# EAGLE design opto_isolator (EAGLE 5.00)
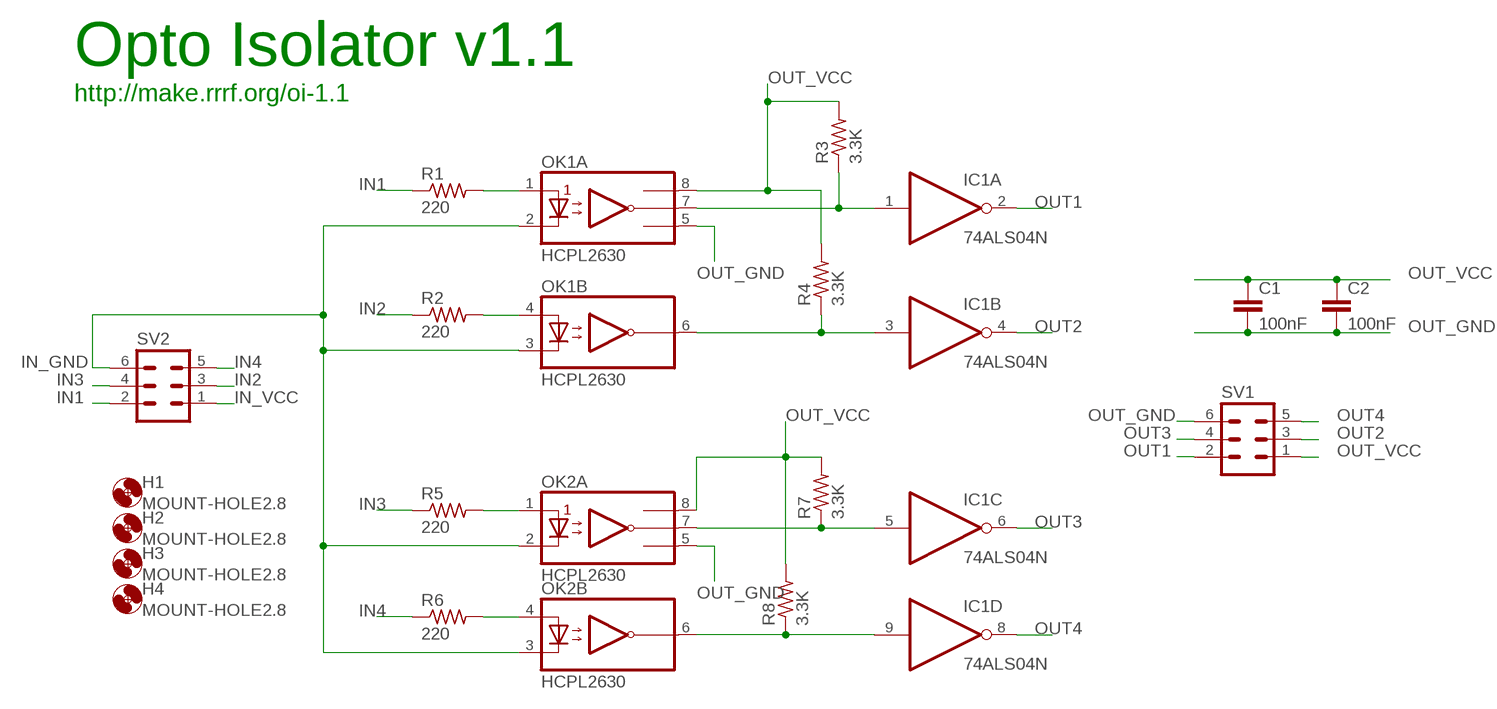
[diagram p0: schematic, sheet 1]

## Parts
C1  100nF  C-EU050-035X075  [C050-035X075]
C2  100nF  C-EU050-035X075  [C050-035X075]
H1  MOUNT-HOLE2.8  [2,8]
H2  MOUNT-HOLE2.8  [2,8]
H3  MOUNT-HOLE2.8  [2,8]
H4  MOUNT-HOLE2.8  [2,8]
IC1  74ALS04N  [DIL14]
OK1  HCPL2630  [DIL08]
OK2  HCPL2630  [DIL08]
R1  220  R-US_0207/2V  [0207/2V]
R2  220  R-US_0207/2V  [0207/2V]
R3  3.3K  R-US_0207/2V  [0207/2V]
R4  3.3K  R-US_0207/2V  [0207/2V]
R5  220  R-US_0207/2V  [0207/2V]
R6  220  R-US_0207/2V  [0207/2V]
R7  3.3K  R-US_0207/2V  [0207/2V]
R8  3.3K  R-US_0207/2V  [0207/2V]
SV1  ML6  [ML6]
SV2  ML6  [ML6]

## Nets
IN1: R1.1 SV2.2
IN2: R2.1 SV2.3
IN3: R5.1 SV2.4
IN4: R6.1 SV2.5
IN_GND: OK1.2(A:C1) OK1.3(B:C2) OK2.2(A:C1) OK2.3(B:C2) SV2.6
IN_VCC: SV2.1
N$1: OK2.4(B:A2) R6.2
N$2: OK2.1(A:A1) R5.2
N$3: OK1.1(A:A1) R1.2
N$4: OK1.4(B:A2) R2.2
N$5: IC1.5(C:I) OK2.7(A:VO1) R7.1
N$6: IC1.9(D:I) OK2.6(B:VO2) R8.1
N$7: IC1.3(B:I) OK1.6(B:VO2) R4.1
N$8: IC1.1(A:I) OK1.7(A:VO1) R3.1
OUT1: IC1.2(A:O) SV1.2
OUT2: IC1.4(B:O) SV1.3
OUT3: IC1.6(C:O) SV1.4
OUT4: IC1.8(D:O) SV1.5
OUT_GND: C1.2 C2.2 OK1.5(A:GND) OK2.5(A:GND) SV1.6
OUT_VCC: C1.1 C2.1 OK1.8(A:VCC) OK2.8(A:VCC) R3.2 R4.2 R7.2 R8.2 SV1.1
Unconnected: IC1.10(E:O) IC1.11(E:I) IC1.12(F:O) IC1.13(F:I)

## Notes on the sheet
- Opto Isolator v1.1
- http://make.rrrf.org/oi-1.1

## Power pins joined to a net without a drawn wire
GND: IC1.7(P:GND)
VCC: IC1.14(P:VCC)

## Library data of the parts
C1 C2 = rcl:C-EU: CAPACITOR, European symbol
H1-H4 = holes:MOUNT-HOLE: MOUNTING HOLE with drill center marker
IC1 = 74xx-us:74*04: Hex INVERTER
OK1 OK2 = optocoupler:HCPL2630: HEWLETT PACKARD OPTO COUPLER
R1-R8 = rcl:R-US_: RESISTOR, American symbol
SV1 SV2 = con-harting-ml:ML6: HARTING

## Board
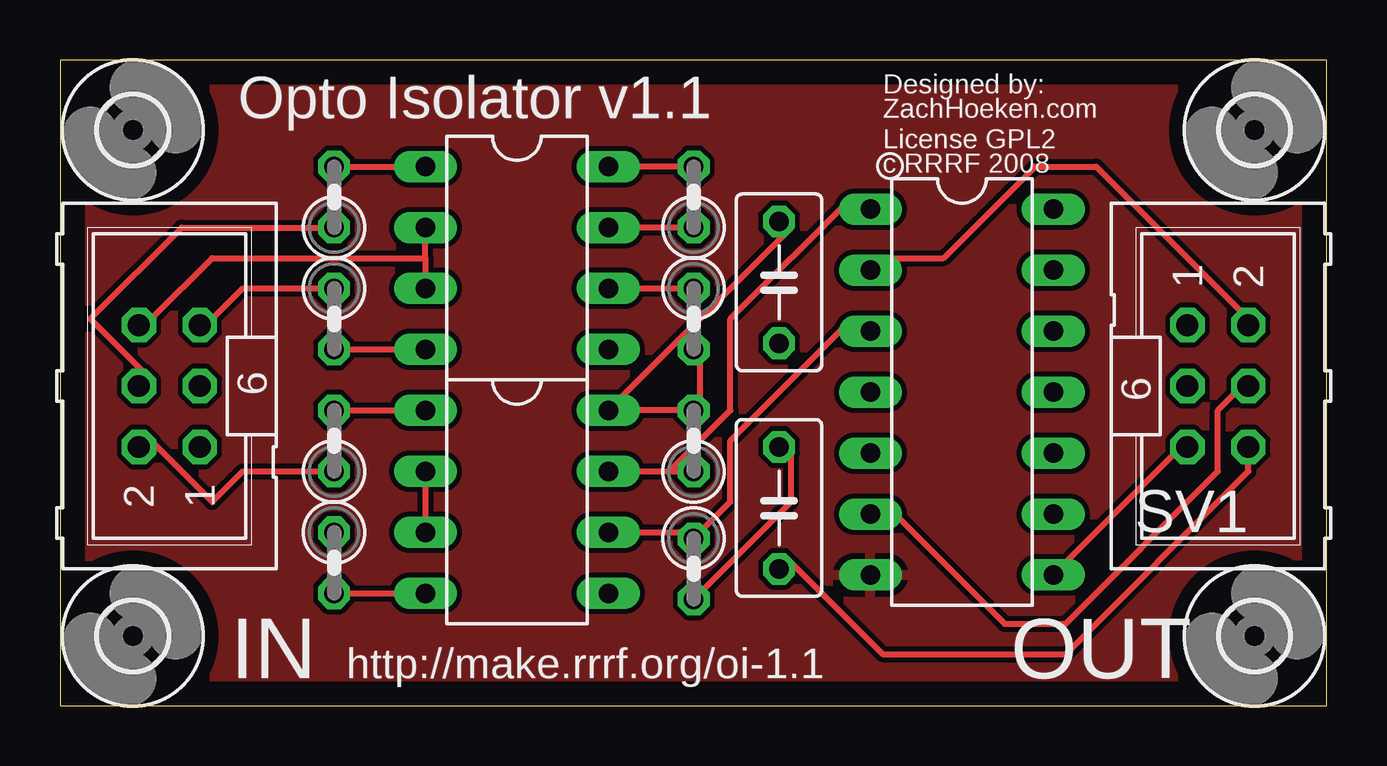
[diagram p1: board, top side]
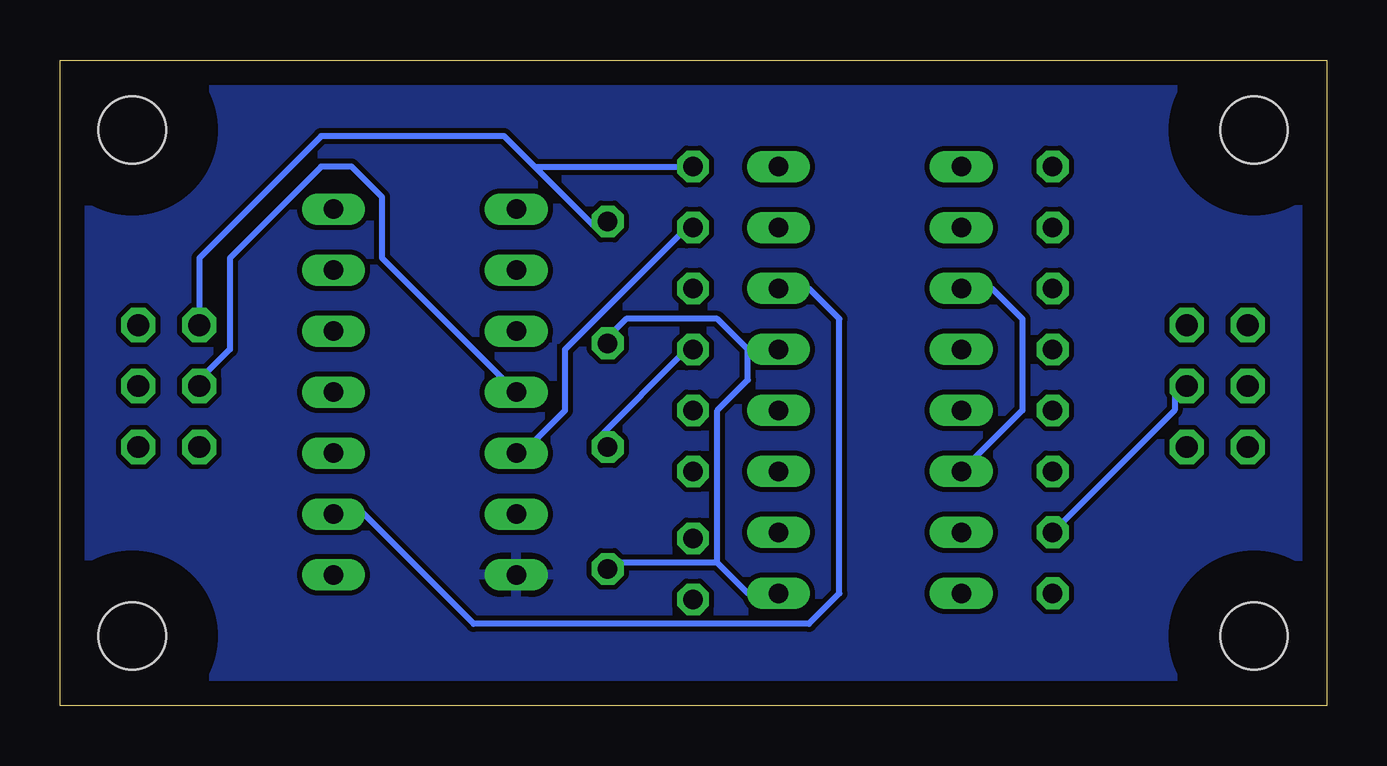
[diagram p2: board, bottom side, seen from below]

Size 52.78 x 26.91 mm. Coordinates in mm from the lower left corner, seen from the top.
Outline: 0,0 52.78,0 52.78,26.91 0,26.91 0,0
Copper layers (1*16): Top 0.035mm / dielectric 1.5mm / Bottom 0.035mm
Design rules "default": minimum track width 10mil, minimum drill 24mil, track to track 8mil, track to pad 8mil, pad to pad 8mil, via to via 8mil, smd to smd 8mil, copper to edge 40mil, drill to drill 8mil, minimum pad ring 10mil, minimum via ring 8mil, stop-mask expansion 4mil, vias tented up to drill 0mil, thermal gap 10mil

### Footprints (pad centres in the part's own frame; a part is rotated, then mirrored left to right if it is on the bottom)
C050-035X075 = drill 0.813 octagon: 1 -2.54,0; 2 2.54,0
2,8 = hole 2.8: 0,0
DIL14 = drill 0.813 long: 1 -7.62,-3.81; 2 -5.08,-3.81; 3 -2.54,-3.81; 4 0,-3.81; 5 2.54,-3.81; 6 5.08,-3.81; 7 7.62,-3.81; 8 7.62,3.81; 9 5.08,3.81; 10 2.54,3.81; 11 0,3.81; 12 -2.54,3.81; 13 -5.08,3.81; 14 -7.62,3.81
DIL08 = drill 0.813 long: 1 -3.81,-3.81; 2 -1.27,-3.81; 3 1.27,-3.81; 4 3.81,-3.81; 5 3.81,3.81; 6 1.27,3.81; 7 -1.27,3.81; 8 -3.81,3.81
0207/2V = drill 0.813 octagon: 1 -1.27,0; 2 1.27,0
ML6 = drill 0.914 octagon: 1 -2.54,-1.27; 2 -2.54,1.27; 3 0,-1.27; 4 0,1.27; 5 2.54,-1.27; 6 2.54,1.27

### Placement (x,y rotation side)
C1  29.96,8.25 270 top
C2  29.96,17.65 270 top
H1  3.04,2.92 0 top
H2  3.04,24 0 top
H3  49.77,2.92 0 top
H4  49.77,24 0 top
IC1  37.58,13.08 270 top
OK1  19.04,8.5 270 top
OK2  19.04,18.66 270 top
R1  11.42,11.04 90 top
R2  11.42,5.96 270 top
R3  26.4,11.04 90 top
R4  26.4,5.71 270 top
R5  11.42,21.2 90 top
R6  11.42,16.12 270 top
R7  26.4,21.2 90 top
R8  26.4,16.12 270 top
SV1  48.25,13.33 270 top
SV2  4.56,13.33 90 top

### Tracks (layer width: path | path; a pad name or v marks a point on that pad's centre or on a via)
GND
  pour Bottom: -0.52,27.55 53.33,27.55 53.33,-0.64 -0.52,-0.64
  pour Top: -0.52,27.55 53.33,27.55 53.33,-0.64 -0.52,-0.64
IN1
  Top 0.254: R1.1 7.61,9.77 6.34,8.5 3.8,11.04 SV2.2
IN2
  Bottom 0.254: R2.1 6.34,12.31 6.34,13.58 SV2.3
IN3
  Top 0.254: R5.1 5.07,19.93 1.26,16.12 3.8,13.58 SV2.4
IN4
  Top 0.254: R6.1 7.61,17.39 6.34,16.12 SV2.5
IN_GND
  Top 0.254: OK1.2 OK1.3 | 15.23,18.66 OK2.2 | 15.23,18.66 OK2.3 | 15.23,18.66 6.34,18.66 3.8,16.12 SV2.6
  Bottom 0.254: OK1.2 12.69,12.31 12.69,16.12 13.96,17.39 OK2.3
N$1
  Top 0.254: R6.2 OK2.4
N$2
  Top 0.254: R5.2 OK2.1
N$3
  Top 0.254: R1.2 OK1.1
N$4
  Top 0.254: R2.2 OK1.4
N$5
  Top 0.254: OK2.7 R7.1 26.66,19.93
  Bottom 0.254: IC1.5 33.01,11.04 31.74,12.31 31.74,14.85 26.66,19.93 R7.1
N$6
  Top 0.254: OK2.6 R8.1 26.66,17.39
  Bottom 0.254: IC1.9 40.63,8.5 35.55,3.42 21.58,3.42 20.31,4.69 20.31,16.12 21.58,17.39 OK2.6
N$7
  Top 0.254: OK1.6 26.66,7.23 | 26.66,7.23 27.93,8.5 27.93,11.04 33.01,16.12 IC1.3 | 26.66,7.23 R4.1
N$8
  Top 0.254: 25.39,9.77 R3.1 26.66,9.77 | OK1.7 25.39,9.77 | 25.39,9.77 27.93,12.31 27.93,16.12 33.01,21.2 IC1.1
OUT1
  Top 0.254: IC1.2 34.28,18.66 36.82,18.66 40.63,22.47 43.17,22.47 49.52,16.12 SV1.2
OUT2
  Bottom 0.254: IC1.4 39.36,18.66 39.36,21.2 40.63,22.47 41.9,22.47 45.71,18.66 45.71,14.85 46.98,13.58 SV1.3
OUT3
  Top 0.254: IC1.6 34.28,8.5 39.36,3.42 41.9,3.42 48.25,9.77 48.25,12.31 49.52,13.58 SV1.4
OUT4
  Top 0.254: IC1.8 46.98,11.04 SV1.5
OUT_GND
  Top 0.254: 49.52,11.04 SV1.6 49.52,9.77 41.9,2.15 34.28,2.15 30.47,5.96 C1.2
  Bottom 0.254: 24.12,14.85 25.39,16.12 29.2,16.12 30.47,14.85 C2.2 | 25.39,5.96 24.12,4.69 OK1.5 | 25.39,5.96 30.47,5.96 C1.2 | 24.12,14.85 24.12,13.58 25.39,12.31 25.39,5.96 | 24.12,14.85 OK2.5
OUT_VCC
  Top 0.254: R4.2 30.47,8.5 30.47,11.04 C1.1 | OK2.8 R7.2 26.66,22.47 | R8.2 26.66,14.85 26.66,12.31 R3.2 OK1.8 30.47,19.93 C2.1
  Bottom 0.254: 33.01,22.47 30.47,19.93 C2.1 | 33.01,22.47 34.28,23.74 41.9,23.74 46.98,18.66 SV1.1 | 33.01,22.47 R7.2 | C1.1 30.47,11.04 26.66,14.85 R8.2

### Text on the board
tPlace: Designed by: | Opto Isolator v1.1 | ZachHoeken.com | License GPL2 | c RRRF 2008 | IN | http://make.rrrf.org/oi-1.1 | OUT